# EAGLE design USBasp_smd_elm008 (EAGLE 4.16)
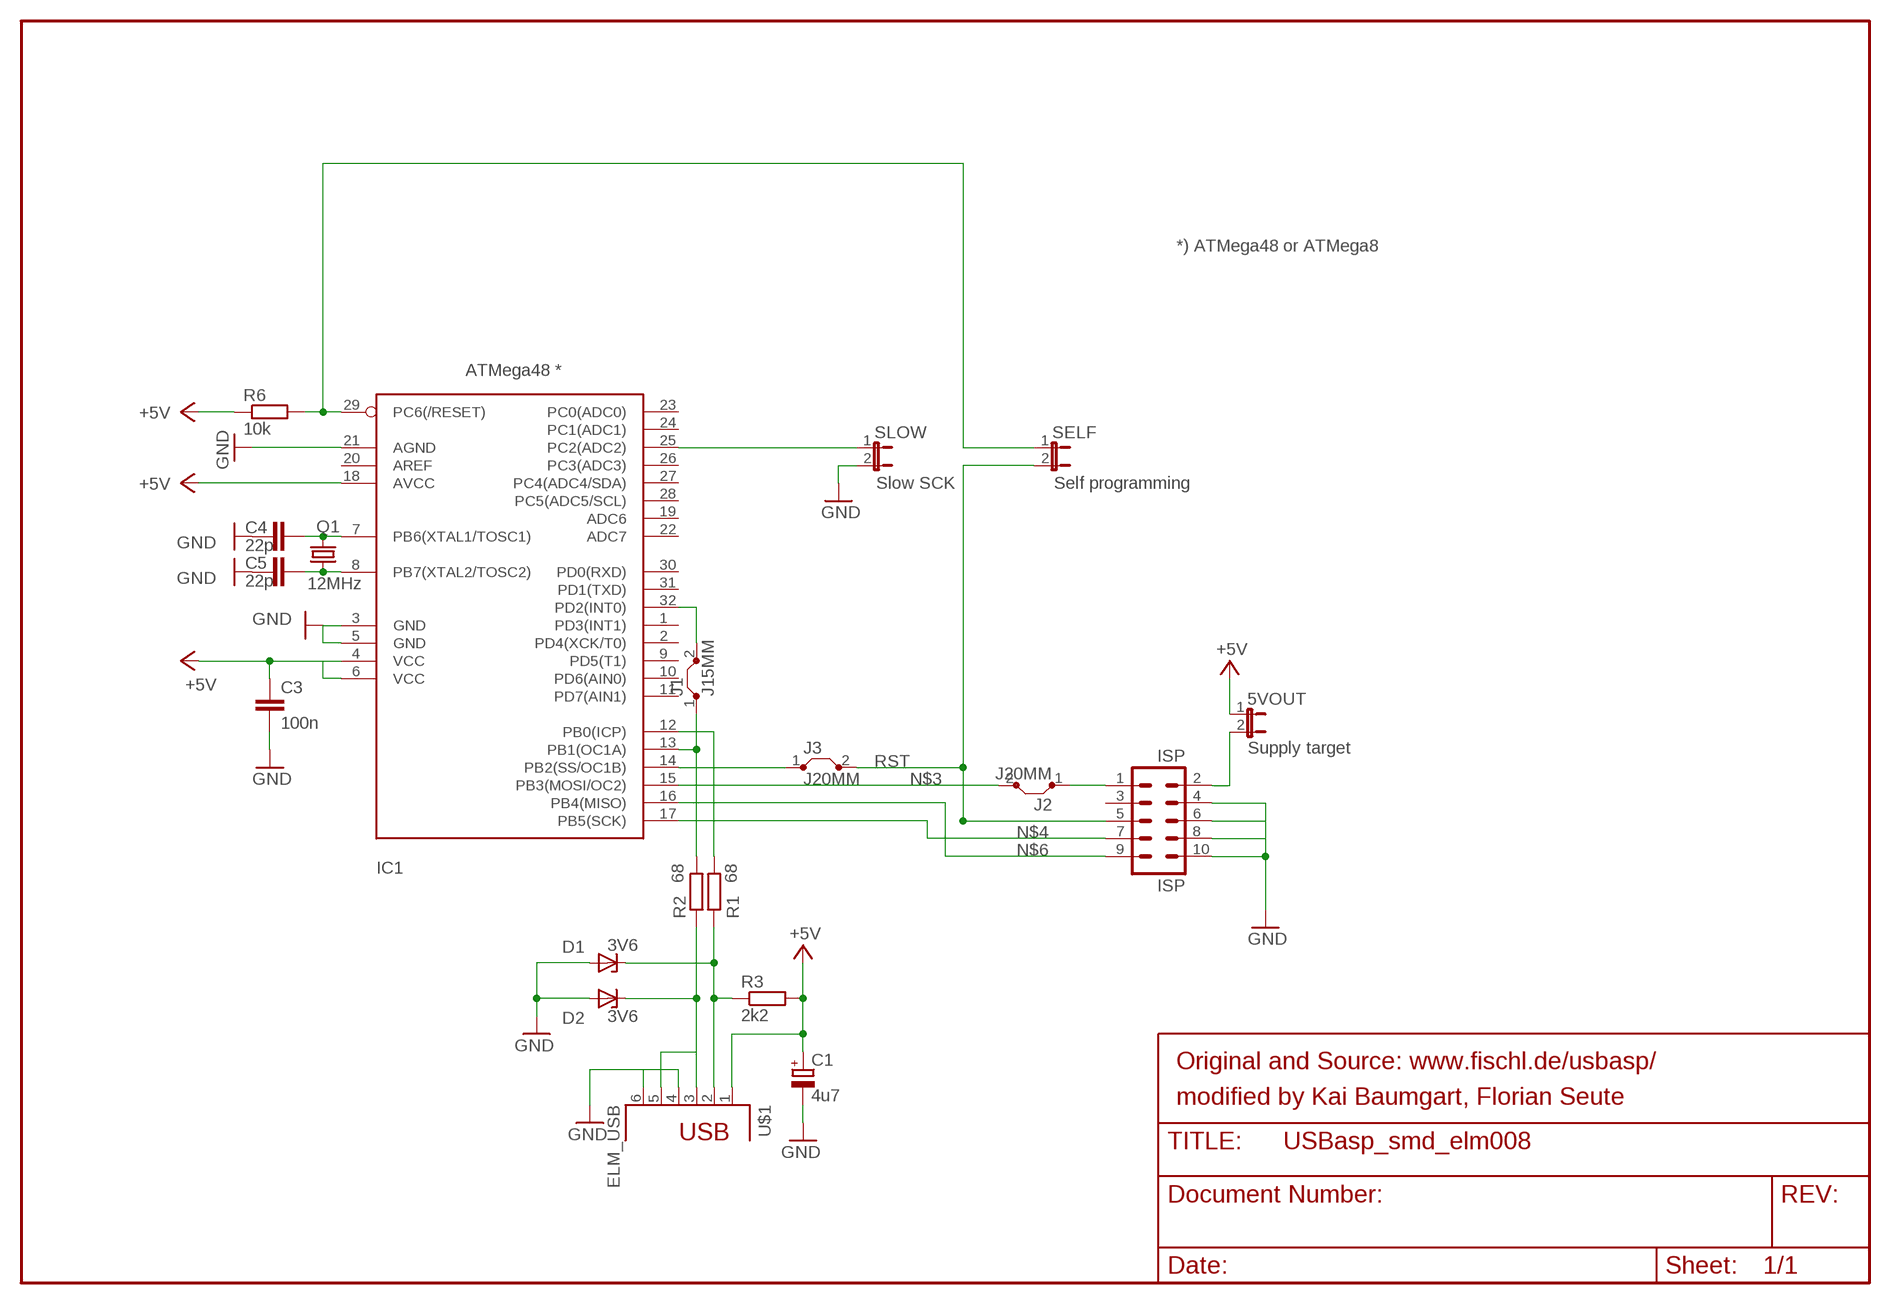
[diagram p0: schematic, sheet 1]

## Parts
5VOUT  Supply target  JP1E  [JP1]
C1  4u7  CPOL-EUE2.5-5  [E2,5-5]
C3  100n  C-EUC0603  [C0603]
C4  22p  C-EUC0603  [C0603]
C5  22p  C-EUC0603  [C0603]
D1  3V6  ZENER-DIODESOT23  [SOT23]
D2  3V6  ZENER-DIODESOT23  [SOT23]
IC1  ATMega48 *  MEGA8-AI  [TQFP32-08]
ISP  ISP  ML10L  [ML10L]
J1  J15MM  [15]
J2  J20MM  [20]
J3  J20MM  [20]
Q1  12MHz  CRYTALHC49S  [HC49/S]
R1  68  R-EU_R0805  [R0805]
R2  68  R-EU_R0805  [R0805]
R3  2k2  R-EU_R0805  [R0805]
R6  10k  R-EU_R0805  [R0805]
SELF  Self programming  JP1E  [JP1]
SLOW  Slow SCK  JP1E  [JP1]
U$1  ELM_USB  [ELM_USB]

## Nets
+5V: 5VOUT.1 C1.+ C3.1 IC1.4(VCC) IC1.6(VCC) IC1.18(AVCC) R3.2 R6.1 U$1.1
GND: C1.- C3.2 C4.1 C5.2 D1.1(A) D2.1(A) IC1.3(GND) IC1.5(GND) IC1.21(AGND) ISP.4 ISP.6 ISP.8 ISP.10 SLOW.2 U$1.4 U$1.6
N$1: IC1.29(PC6(/RESET)) R6.2 SELF.1
N$2: IC1.32(PD2(INT0)) J1.2
N$3: IC1.15(PB3(MOSI/OC2)) J2.2
N$4: IC1.17(PB5(SCK)) ISP.7
N$5: D1.3(C) R1.1 R3.1 U$1.2
N$6: IC1.16(PB4(MISO)) ISP.9
N$7: IC1.13(PB1(OC1A)) J1.1 R2.2
N$8: D2.3(C) R2.1 U$1.3 U$1.5
N$9: ISP.1 J2.1
N$10: IC1.14(PB2(SS/OC1B)) J3.1
N$12: IC1.25(PC2(ADC2)) SLOW.1
N$17: 5VOUT.2 ISP.2
N$20: IC1.12(PB0(ICP)) R1.2
N$22: C4.2 IC1.7(PB6(XTAL1/TOSC1)) Q1.2
N$23: C5.1 IC1.8(PB7(XTAL2/TOSC2)) Q1.1
RST: ISP.5 J3.2 SELF.2
Unconnected: IC1.1(PD3(INT1)) IC1.2(PD4(XCK/T0)) IC1.9(PD5(T1)) IC1.10(PD6(AIN0)) IC1.11(PD7(AIN1)) IC1.19(ADC6) IC1.20(AREF) IC1.22(ADC7) IC1.23(PC0(ADC0)) IC1.24(PC1(ADC1)) IC1.26(PC3(ADC3)) IC1.27(PC4(ADC4/SDA)) IC1.28(PC5(ADC5/SCL)) IC1.30(PD0(RXD)) IC1.31(PD1(TXD)) ISP.3

## Notes on the sheet
- *) ATMega48 or ATMega8
- Original and Source: www.fischl.de/usbasp/
- modified by Kai Baumgart, Florian Seute

## Library data of the parts
5VOUT SELF SLOW = jumper:JP1E: JUMPER
C1 = rcl:CPOL-EU: POLARIZED CAPACITOR, European symbol
C3-C5 = rcl:C-EU: CAPACITOR, European symbol
D1 D2 = diode:ZENER-DIODE: Z-Diode
IC1 = atmel:MEGA8: MICROCONTROLLER 8 Kbytes FLASH 1 kbytes SRAM 512 bytes EEPROM USART 6-channel 10 bit ADC 2-channel 8 bit ADC Source: avr.lbr
ISP = con-harting-ml:ML10: HARTING
J1-J3 = jumper:J: Bridge
Q1 = crystal:CRYTAL: CRYSTAL
R1-R3 R6 = rcl:R-EU_: RESISTOR, European symbol
U$1 = con-elm:ELM_USB

## Board
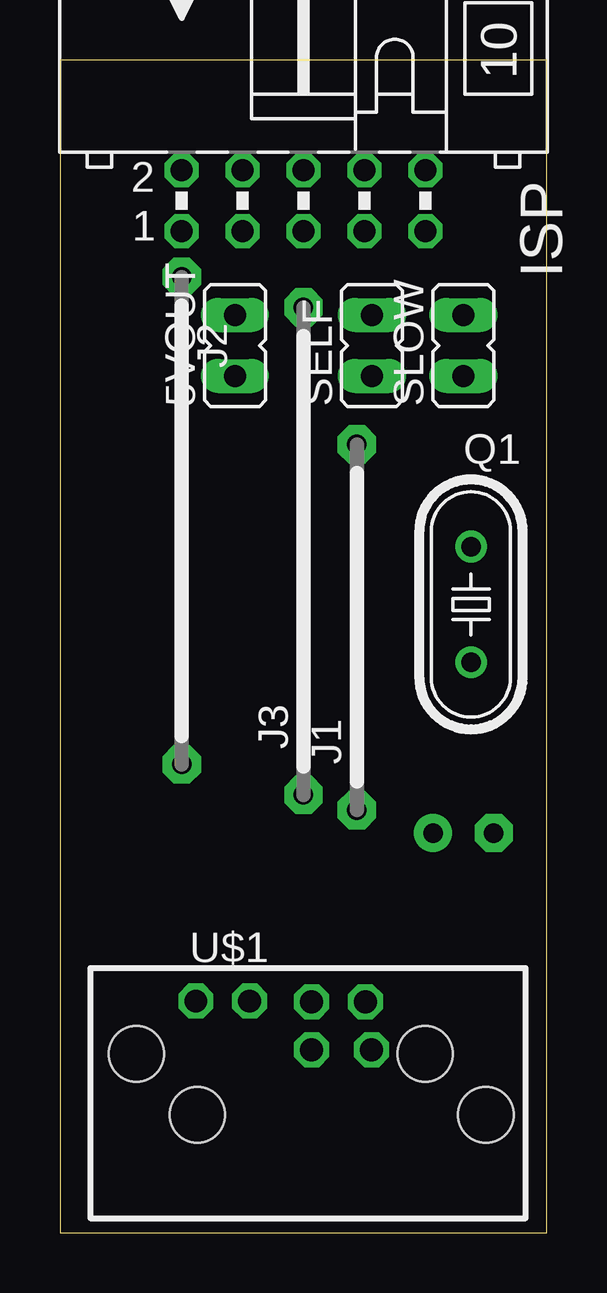
[diagram p1: board, top side]
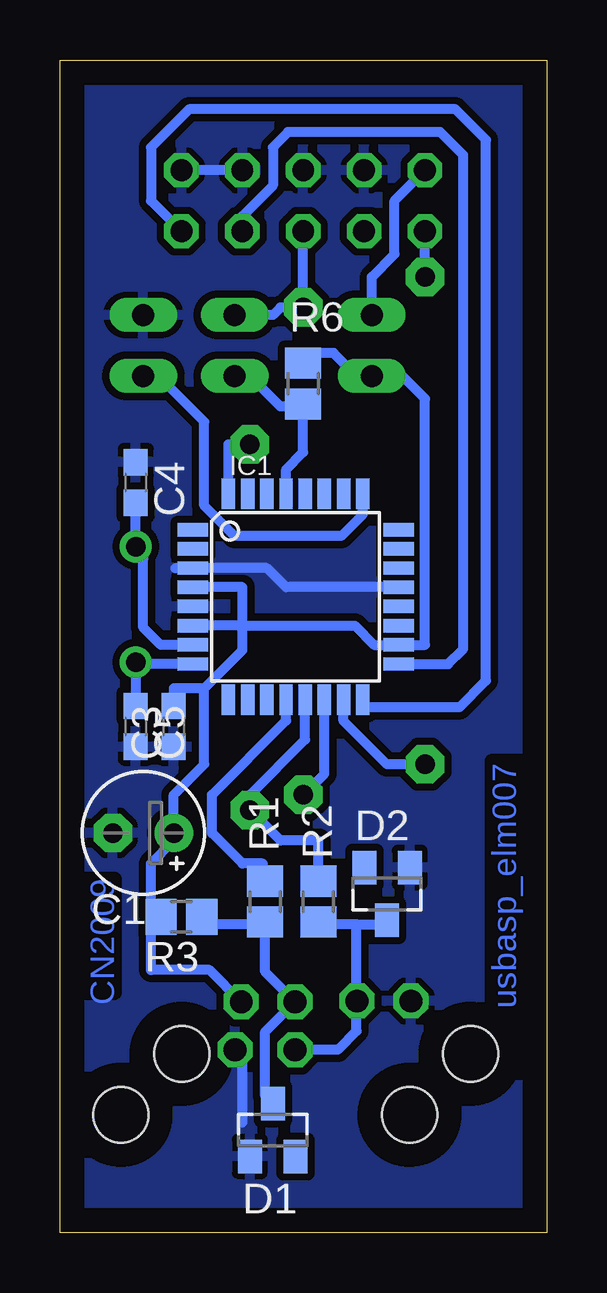
[diagram p2: board, bottom side, seen from below]

Size 20.3 x 48.88 mm. Coordinates in mm from the lower left corner, seen from the top.
Outline: 0,0 20.3,0 20.3,48.88 0,48.88 0,0
Copper layers (1*16): Top 0.035mm / dielectric 1.5mm / Bottom 0.035mm
Design rules "olimex_8mils": minimum track width 10mil, minimum drill 24mil, track to track 8mil, track to pad 8mil, pad to pad 8mil, via to via 8mil, smd to smd 8mil, copper to edge 40mil, drill to drill 10mil, minimum pad ring 10mil, minimum via ring 8mil, stop-mask expansion 0mil, vias tented up to drill 0mil, thermal gap 10mil

### Footprints (pad centres in the part's own frame; a part is rotated, then mirrored left to right if it is on the bottom)
JP1 = drill 0.914 long: 1 0,-1.27; 2 0,1.27
E2,5-5 = drill 0.813 pad 1.6 round: + -1.27,0 | drill 0.813 pad 1.6 octagon: - 1.27,0
C0603 = smd 1.1 x 1: 1 -0.85,0; 2 0.85,0
SOT23 = smd 1 x 1.4: 1 -0.95,-1.1; 2 0.95,-1.1; 3 0,1.1
TQFP32-08 = smd 1.27 x 0.559: 1 -4.293,2.8; 2 -4.293,2; 3 -4.293,1.2; 4 -4.293,0.4; 5 -4.293,-0.4; 6 -4.293,-1.2; 7 -4.293,-2; 8 -4.293,-2.8; 17 4.293,-2.8; 18 4.293,-2; 19 4.293,-1.2; 20 4.293,-0.4; 21 4.293,0.4; 22 4.293,1.2; 23 4.293,2; 24 4.293,2.8 | smd 0.559 x 1.27: 9 -2.8,-4.293; 10 -2,-4.293; 11 -1.2,-4.293; 12 -0.4,-4.293; 13 0.4,-4.293; 14 1.2,-4.293; 15 2,-4.293; 16 2.8,-4.293; 25 2.8,4.293; 26 2,4.293; 27 1.2,4.293; 28 0.4,4.293; 29 -0.4,4.293; 30 -1.2,4.293; 31 -2,4.293; 32 -2.8,4.293
ML10L = drill 0.914 octagon: 1 -5.08,-1.27; 2 -5.08,1.27; 3 -2.54,-1.27; 4 -2.54,1.27; 5 0,-1.27; 6 0,1.27; 7 2.54,-1.27; 8 2.54,1.27; 9 5.08,-1.27; 10 5.08,1.27
15 = drill 0.813 pad 1.6 octagon: 1 -7.62,0; 2 7.62,0
20 = drill 0.813 pad 1.6 octagon: 1 -10.16,0; 2 10.16,0
HC49/S = drill 0.813 round: 1 -2.413,0; 2 2.413,0
R0805 = smd 1.3 x 1.5: 1 -0.85,0; 2 0.85,0
ELM_USB = drill 0.95 octagon: 1 2.266,4.71; 2 0.02,4.71; 3 0.02,2.71; 4 2.52,2.71; 5 -2.56,4.742; 6 -4.806,4.742 | hole 2.3: -4.75,0; 7.29,0; 7.29,0; 4.75,2.54; -7.29,2.54

### Placement (x,y rotation side)
5VOUT  7.3,36.98 0 top
C1  16.82,16.66 180 bottom
C3  15.55,21.11 270 bottom
C4  17.14,31.27 270 bottom
C5  17.14,21.11 270 bottom
D1  11.43,4.28 0 bottom
D2  6.66,14.12 180 bottom
IC1  10.47,26.5 0 bottom
ISP  10.16,43.02 0 top
J1  12.38,25.23 90 top
J2  5.07,29.68 270 top
J3  10.16,28.41 90 top
Q1  17.14,26.19 90 top
R1  11.74,13.8 90 bottom
R2  9.52,13.8 90 bottom
R3  15.23,13.17 180 bottom
R6  10.16,35.4 270 bottom
SELF  13.01,36.98 0 top
SLOW  16.82,36.98 0 top
U$1  10.47,4.92 0 top

### Tracks (layer width: path | path; a pad name or v marks a point on that pad's centre or on a via)
+5V
  Bottom 0.406: 7.61,35.5 6.45,35.5 5VOUT.1 | IC1.4 12.69,26.91 12.69,25.23 | 12.69,25.3 8,25.3 7.2,24.5 IC1.18 5.07,24.5 5.07,34.76 6.03,35.71 5VOUT.1 | 12.69,25.3 IC1.6 | 12.69,25.23 12.69,25.3 | 12.69,25.23 12.69,24.28 14.28,22.69 | R6.1 10.16,36.66 8.88,36.66 7.93,35.71 5VOUT.1 | 16.5,13.17 16.5,13.12 | 16.5,13.17 16.5,15.39 15.55,16.34 C1.+ 15.55,18.25 14.28,19.52 14.28,22.69 | C3.1 15.55,22.69 14.28,22.69 | U$1.1 14.06,10.95 16.5,10.95 16.5,13.17 | 16.5,13.17 R3.2
GND
  Bottom 0.406: IC1.21 10.87,26.91 11.67,27.71 IC1.3 15.48,27.71 | ISP.8 ISP.10 | U$1.4 12.69,7.33 12.69,4.6
  pour Bottom (isolate 0.305): -0.01,49.05 -0.01,-0.16 20,-0.16 20,49.05
N$1
  Bottom 0.406: IC1.29 10.87,31.82 10.16,32.54 10.16,34.44 | SELF.1 12.38,35.71 11.11,34.44 10.16,34.44 | 10.16,34.44 R6.2
N$2
  Bottom 0.406: IC1.32 13.27,32.85 J1.2
N$3
  Bottom 0.406: IC1.15 8.47,21.33 6.66,19.52 J2.2
N$4
  Bottom 0.406: ISP.7 12.69,42.38 11.43,43.65 11.43,45.24 10.79,45.87 4.44,45.87 3.49,44.92 3.49,24.34 4.12,23.71 IC1.17
N$5
  Bottom 0.406: D1.3 11.74,5.7 11.74,8.37 U$1.2 11.74,10.87 11.74,12.85 | 11.74,12.85 R1.1 | R3.1 14.38,12.85 11.74,12.85
N$6
  Bottom 0.406: IC1.16 7.61,22.06 7.61,21.89 3.65,21.89 2.54,23.01 2.54,45.55 3.81,46.83 14.92,46.83 16.5,45.24 16.5,43.02 ISP.9
N$7
  Bottom 0.406: IC1.13 10.07,20.55 12.38,18.25 J1.1 11.11,16.34 9.52,16.34 R2.2
N$8
  Bottom 0.406: 7.93,9.66 U$1.5 | U$1.3 8.71,7.62 7.93,8.41 7.93,9.66 | 7.93,9.66 7.93,12.85 | D2.3 6.83,12.85 7.93,12.85 | R2.1 9.52,12.85 7.93,12.85
N$9
  Bottom 0.406: J2.1 ISP.1
N$10
  Bottom 0.406: IC1.14 9.27,19.13 J3.1
N$12
  Bottom 0.406: IC1.25 7.67,29.94 8.57,29.05 13.01,29.05 14.28,30.32 14.28,33.81 16.19,35.71 SLOW.1
N$17
  Bottom 0.406: 5VOUT.2 7.3,39.84 6.35,40.79 6.35,43.02 ISP.2
N$20
  Bottom 0.406: R1.2 11.85,15.39 12.69,15.39 13.96,16.66 13.96,18.25 10.87,21.34 IC1.12
N$22
  Bottom 0.406: IC1.7 16.09,24.5 16.82,25.23 16.82,28.09 17.14,28.41 Q1.2 C4.2
N$23
  Bottom 0.406: IC1.8 16.88,23.71 16.88,23.65 17.14,23.65 | 17.14,23.65 C5.1 | 17.14,23.65 Q1.1
RST
  Bottom 0.406: SELF.2 11.43,38.25 11.11,38.57 J3.2 ISP.5

### Text on the board
Bottom: CN2009 | usbasp_elm007
_tNames: ISP | 5VOUT | SELF | SLOW | Q1 | USB | S1
_bNames: LED2 | R5 | R7 | R4 | IC1 | R6 | LED1 | C4 | C3 | C5 | R1 | R3 | R2 | C1 | D2 | D1
_tValues: ISP | USB